# EAGLE schematic max232 (EAGLE 7.5.0)
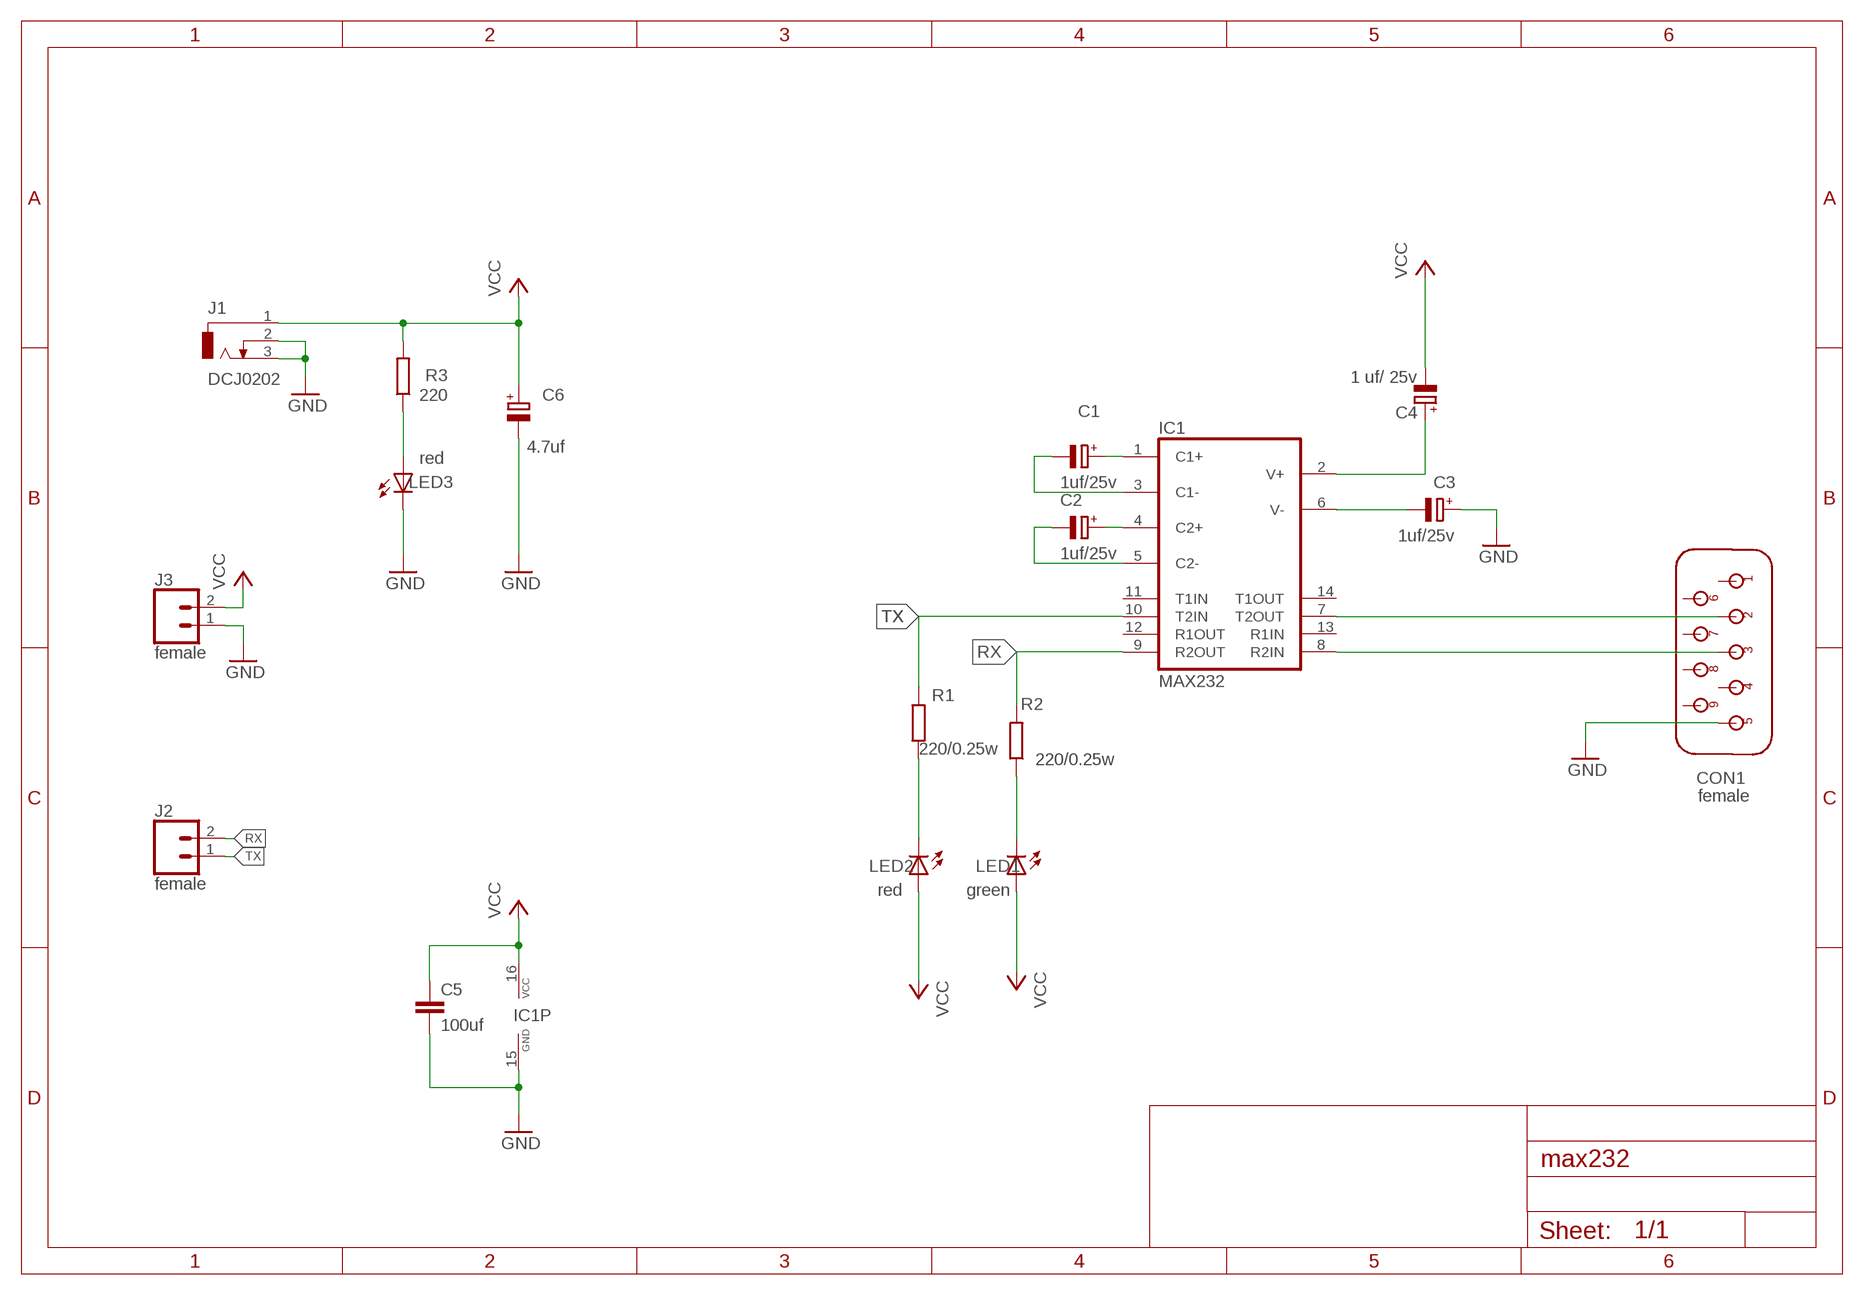
[diagram p0: schematic, sheet 1]

## Parts
C1  1uf/25v  CPOL-EUE2.5-6  [E2,5-6]
C2  1uf/25v  CPOL-EUE2.5-6  [E2,5-6]
C3  1uf/25v  CPOL-EUE2.5-6  [E2,5-6]
C4  1 uf/ 25v  CPOL-EUE2.5-6  [E2,5-6]
C5  100uf  C-EU025-024X044  [C025-024X044]
C6  4.7uf  CPOL-EUE2.5-6  [E2,5-6]
CON1  female  DB9F/90  [D-09F/90]
IC1  MAX232  [DIL16]
J1  DCJ0202  [DCJ0202]
J2  female  CONN_02  [1X02]
J3  female  CONN_02  [1X02]
LED1  green  LED3MM  [LED3MM]
LED2  red  LED3MM  [LED3MM]
LED3  red  LED3MM  [LED3MM]
R1  220/0.25w  R-EU_0207/10  [0207/10]
R2  220/0.25w  R-EU_0207/10  [0207/10]
R3  220  R-EU_0207/10  [0207/10]

## Nets
GND: C3.+ C5.2 C6.- CON1.5 IC1.15(GND) J1.2 J1.3 J3.1 LED3.K(C)
N$1: C1.+ IC1.1(C1+)
N$2: C1.- IC1.3(C1-)
N$3: C2.+ IC1.4(C2+)
N$4: C2.- IC1.5(C2-)
N$5: C4.+ IC1.2(V+)
N$6: C3.- IC1.6(V-)
N$7: CON1.2 IC1.7(T2OUT)
N$8: CON1.3 IC1.8(R2IN)
N$9: LED2.K(C) R1.1
N$10: LED1.K(C) R2.1
N$12: LED3.A R3.1
RX: IC1.9(R2OUT) J2.2 R2.2
TX: IC1.10(T2IN) J2.1 R1.2
VCC: C4.- C5.1 C6.+ IC1.16(VCC) J1.1 J3.2 LED1.A LED2.A R3.2
Unconnected: CON1.1 CON1.4 CON1.6 CON1.7 CON1.8 CON1.9 IC1.11(T1IN) IC1.12(R1OUT) IC1.13(R1IN) IC1.14(T1OUT)

## Library data of the parts
C1-C4 C6 = untitled:CPOL-EU: POLARIZED CAPACITOR, European symbol
C5 = untitled:C-EU: CAPACITOR, European symbol
CON1 = untitled:DB9F/90
IC1 = untitled:MAX232: RS232 TRANSCEIVER; MF: MAXIM; MPN: MAX232ACPE+; OC_FARNELL: 9723773; OC_NEWARK: 68K4544
J1 = untitled:DCJ0202: DC POWER JACK Source: DCJ0202.pdf; OC_FARNELL: unknown; OC_NEWARK: unknown
J2 J3 = untitled:CONN_02: Multi connection point. Often used as Generic Header-pin footprint for 0.1 inch spaced/style header connections On any of the 0.1 inch spaced packages, you can populate with these: Break Away Headers - Straight <https://www.sparkfun.com/products/116> (PRT-00116) Break Away Male Headers - Right Angle <https://www.sparkfun.com/products/553> (PRT-00553) Female Headers <https://www.sparkfun.com/products/115> (PRT-00115) Break Away Headers - Machine Pin <https://www.sparkfun.com/products/117> (PRT-00117) Break Away Female Headers - Swiss Machine Pin <https://www.sparkfun.com/products/743> (PRT-00743) For SCREWTERMINALS and SPRING TERMINALS visit here: Screw Terimnals on SparkFun.com <https://www.sparkfun.com/search/results?term=Screw+Terminals> (5mm/3.5mm/2.54mm spacing) This device is also useful as a general connection point to wire up your design to another part of your project. Our various solder wires solder well into these plated through hole pads. Hook-Up Wire - Assortment (Stranded, 22 AWG) <https://www.sparkfun.com/products/11375> (PRT-11375) Hook-Up Wire - Assortment (Solid Core, 22 AWG) <https://www.sparkfun.com/products/11367> (PRT-11367) View the entire wire category on our website here <https://www.sparkfun.com/categories/141> Special notes: Molex polarized connector foot print use with: PRT-08233 with associated crimp pins and housings. 2.54_SCREWTERM for use with PRT-10571. 3.5mm Screw Terminal footprints for PRT-08084 5mm Screw Terminal footprints for use with PRT-08432
LED1-LED3 = led:LED: LED OSRAM: - CHIPLED LG R971, LG N971, LY N971, LG Q971, LY Q971, LO R971, LY R971 LH N974, LH R974 LS Q976, LO Q976, LY Q976 LO Q996 - Hyper CHIPLED LW Q18S LB Q993, LB Q99A, LB R99A - SideLED LS A670, LO A670, LY A670, LG A670, LP A670 LB A673, LV A673, LT A673, LW A673 LH A674 LY A675 LS A676, LA A676, LO A676, LY A676, LW A676 LS A679, LY A679, LG A679 - Hyper Micro SIDELED® LS Y876, LA Y876, LO Y876, LY Y876 LT Y87S - SmartLED LW L88C, LW L88S LB L89C, LB L89S, LG L890 LS L89K, LO L89K, LY L89K LS L896, LA L896, LO L896, LY L896 - TOPLED LS T670, LO T670, LY T670, LG T670, LP T670 LSG T670, LSP T670, LSY T670, LOP T670, LYG T670 LG T671, LOG T671, LSG T671 LB T673, LV T673, LT T673, LW T673 LH T674 LS T676, LA T676, LO T676, LY T676, LB T676, LH T676, LSB T676, LW T676 LB T67C, LV T67C, LT T67C, LS T67K, LO T67K, LY T67K, LW E67C LS E67B, LA E67B, LO E67B, LY E67B, LB E67C, LV E67C, LT E67C LW T67C LS T679, LY T679, LG T679 LS T770, LO T770, LY T770, LG T770, LP T770 LB T773, LV T773, LT T773, LW T773 LH T774 LS E675, LA E675, LY E675, LS T675 LS T776, LA T776, LO T776, LY T776, LB T776 LHGB T686 LT T68C, LB T68C - Hyper Mini TOPLED® LB M676 - Mini TOPLED Santana® LG M470 LS M47K, LO M47K, LY M47K Source: http://www.osram.convergy.de LUXEON: - LUMILED® LXK2-PW12-R00, LXK2-PW12-S00, LXK2-PW14-U00, LXK2-PW14-V00 LXK2-PM12-R00, LXK2-PM12-S00, LXK2-PM14-U00 LXK2-PE12-Q00, LXK2-PE12-R00, LXK2-PE12-S00, LXK2-PE14-T00, LXK2-PE14-U00 LXK2-PB12-K00, LXK2-PB12-L00, LXK2-PB12-M00, LXK2-PB14-N00, LXK2-PB14-P00, LXK2-PB14-Q00 LXK2-PR12-L00, LXK2-PR12-M00, LXK2-PR14-Q00, LXK2-PR14-R00 LXK2-PD12-Q00, LXK2-PD12-R00, LXK2-PD12-S00 LXK2-PH12-R00, LXK2-PH12-S00 LXK2-PL12-P00, LXK2-PL12-Q00, LXK2-PL12-R00 Source: www.luxeon.com KINGBRIGHT: KA-3528ASYC Source: www.kingbright.com
R1-R3 = untitled:R-EU_: RESISTOR, European symbol